# Altium schematic sheet 013_SoC GPIO 3.3V.SchDoc
size 420 x 297 mm; Page Create Date: May 29, 2006; WebSite: https://www.seeedstudio.com; Page Number: 13; Drawing: qxn; Schematic Name: BeaglePlay; Page Size: A3; Comment: Seeed Title; Page Count: 22; Page Name: 013_SoC GPIO 3.3V; Company: Seeed Studio; RevCode: v0.2; DsnPath: C:\Users\a0488739\Documents\GitHub\beagleplay\allegro\DVT\BEAGLEPLAYV020_220915.DSN; SchematicName: BeaglePlay; PageName: 013_SoC GPIO 3.3V; PageSize: A3; TopSchematic: True
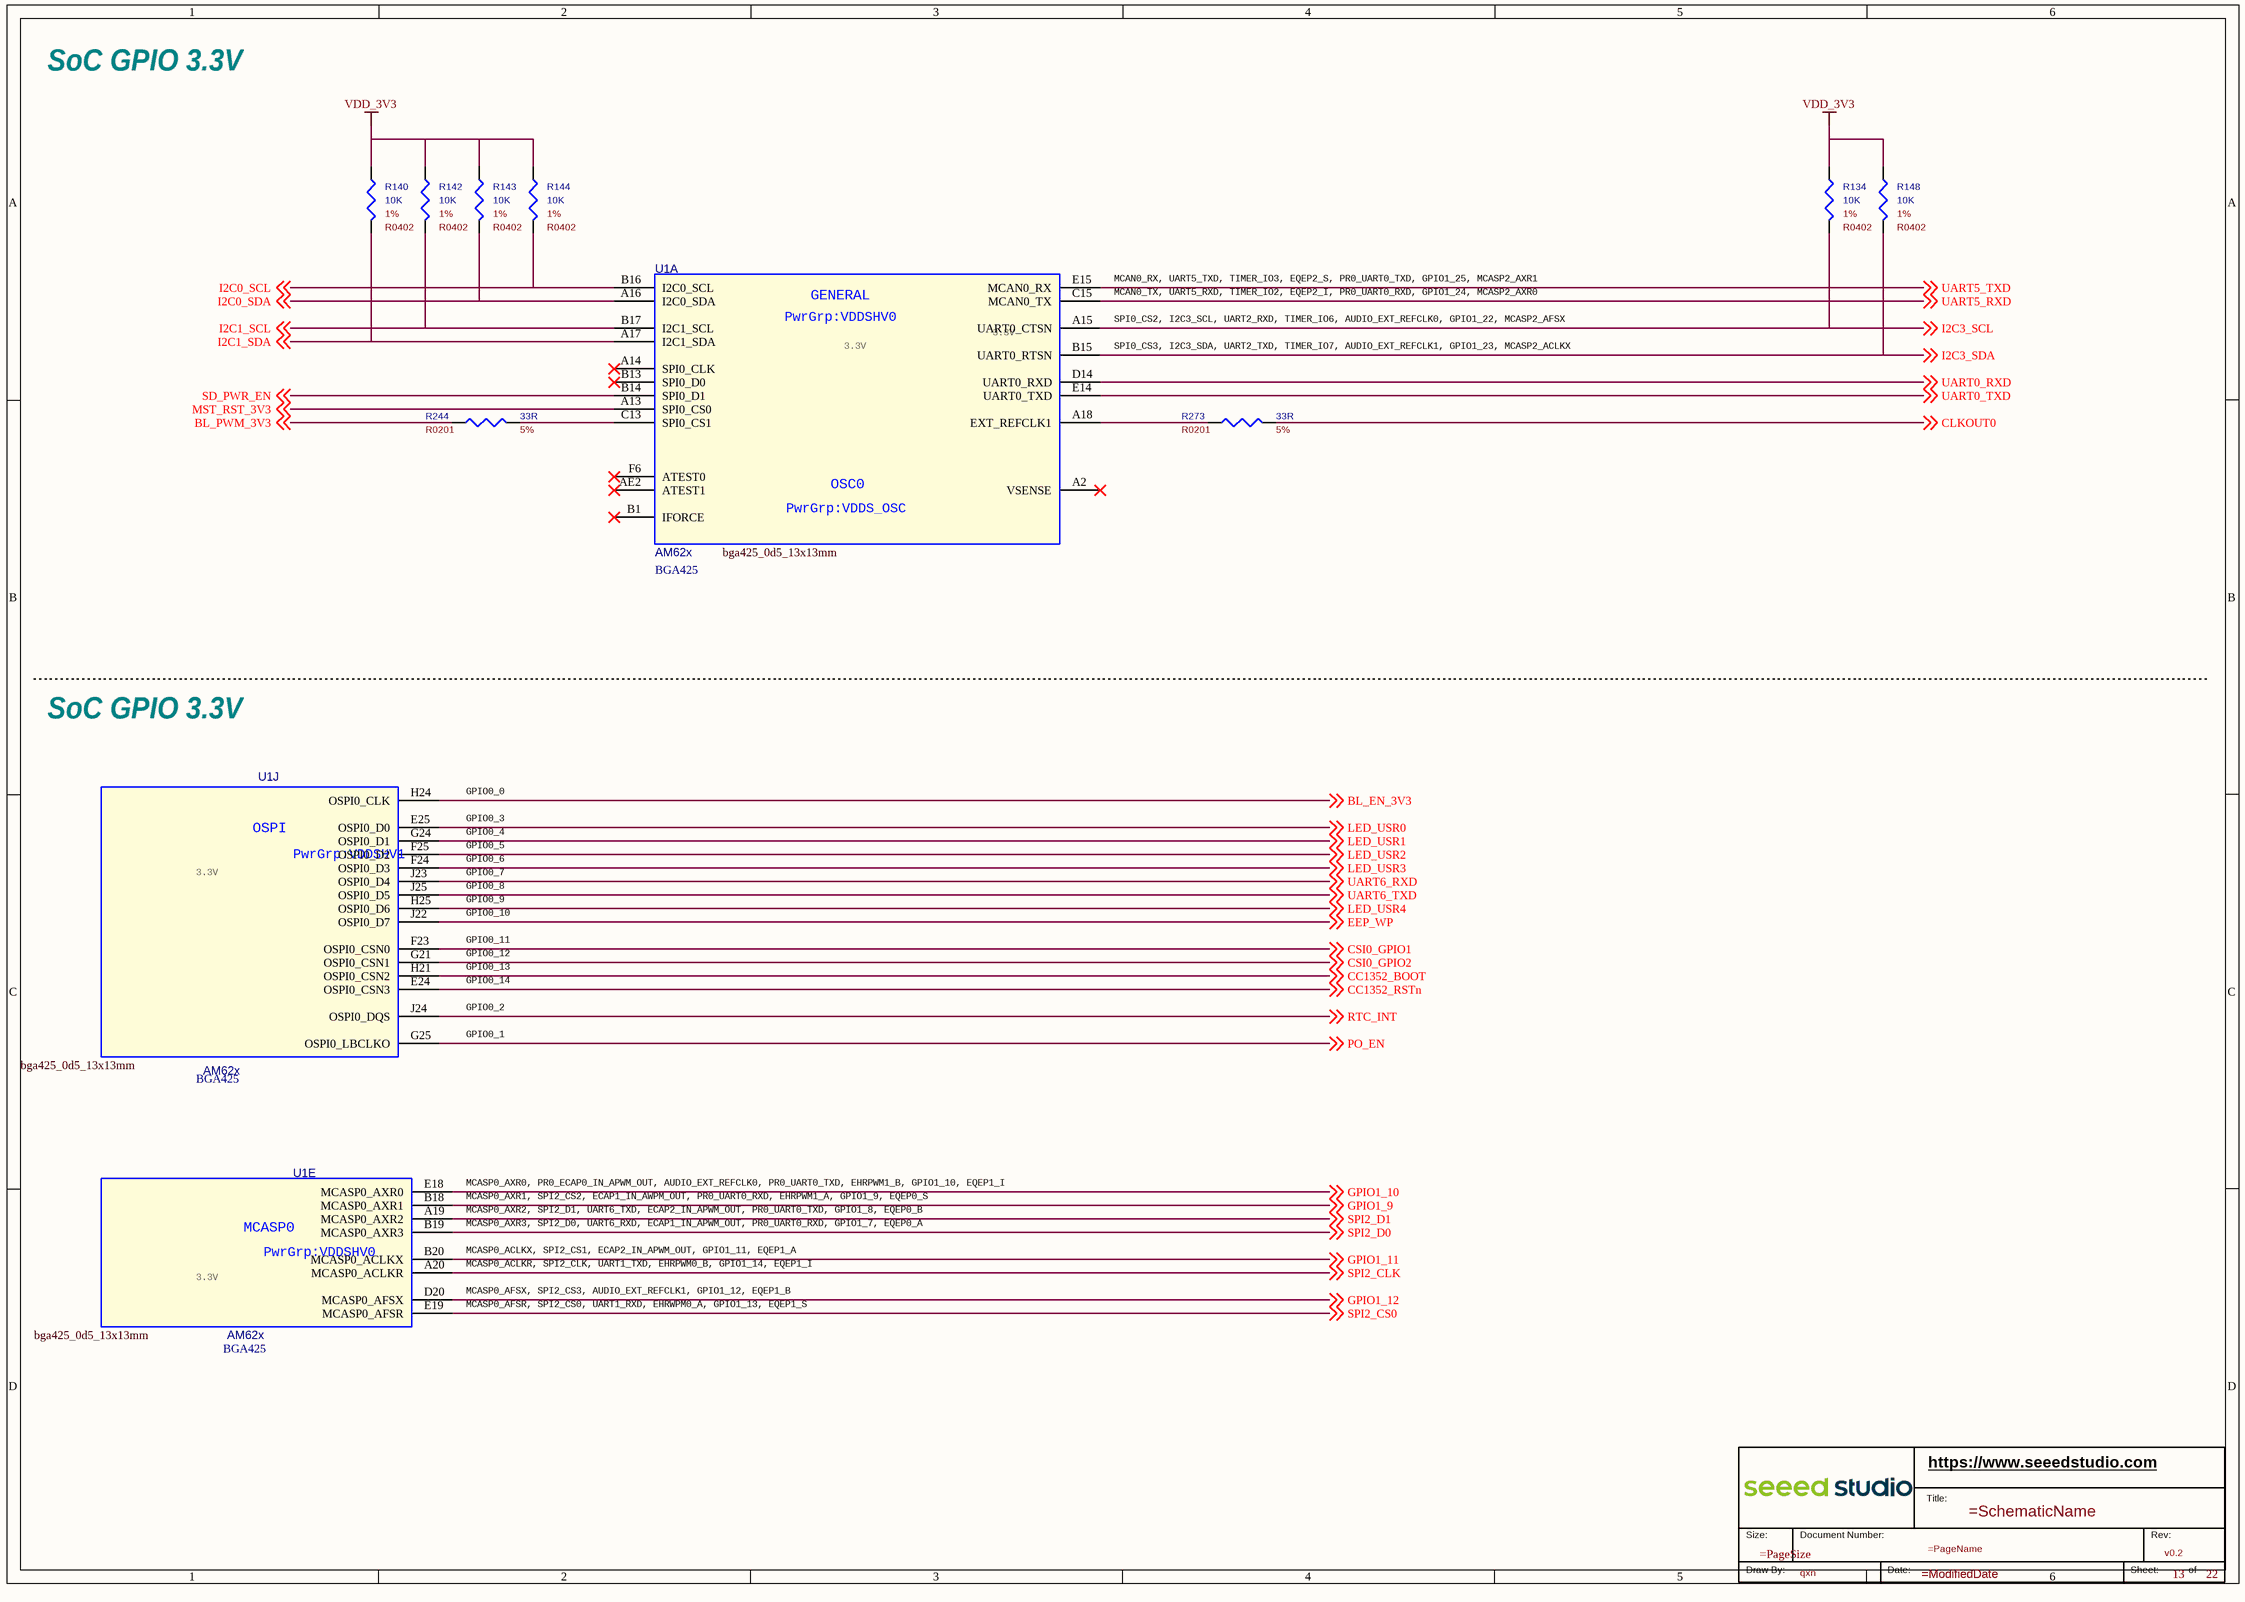
[diagram p0: 013_SoC GPIO 3.3V.SchDoc]

## Parts
*  RevCode: v0.2  Page Number: 13  Page Count: 22  Drawing: qxn  (hidden comment: Seeed Title)  (graphical)
R134  value 10K  Rating: 1%  [R0402]  (hidden comment: R)
R140  value 10K  Rating: 1%  [R0402]  (hidden comment: R)
R142  value 10K  Rating: 1%  [R0402]  (hidden comment: R)
R143  value 10K  Rating: 1%  [R0402]  (hidden comment: R)
R144  value 10K  Rating: 1%  [R0402]  (hidden comment: R)
R148  value 10K  Rating: 1%  [R0402]  (hidden comment: R)
R244  value 33R  Rating: 5%  [R0201]  (hidden comment: R)
R273  value 33R  Rating: 5%  [R0201]  (hidden comment: R)
U1  value AM62x  Package Size: BGA425  [bga425_0d5_13x13mm]  (hidden comment: AM62x_BGA425)  (parts A,E,J of 19)

## Nets
VDD_3V3: R134.1 R140.1 R142.1 R143.1 R144.1 R148.1
BL_EN_3V3: U1.H24(OSPI0_CLK) ; off-sheet BL_EN_3V3
BL_PWM_3V3: R244.1 ; off-sheet BL_PWM_3V3
CC1352_BOOT: U1.H21(OSPI0_CSN2) ; off-sheet CC1352_BOOT
CC1352_RSTn: U1.E24(OSPI0_CSN3) ; off-sheet CC1352_RSTn
CLKOUT0: R273.2 ; off-sheet CLKOUT0
CSI0_GPIO1: U1.F23(OSPI0_CSN0) ; off-sheet CSI0_GPIO1
CSI0_GPIO2: U1.G21(OSPI0_CSN1) ; off-sheet CSI0_GPIO2
EEP_WP: U1.J22(OSPI0_D7) ; off-sheet EEP_WP
GPIO1_9: U1.B18(MCASP0_AXR1) ; off-sheet GPIO1_9
GPIO1_10: U1.E18(MCASP0_AXR0) ; off-sheet GPIO1_10
GPIO1_11: U1.B20(MCASP0_ACLKX) ; off-sheet GPIO1_11
GPIO1_12: U1.D20(MCASP0_AFSX) ; off-sheet GPIO1_12
I2C0_SCL: R144.2 U1.B16(I2C0_SCL) ; off-sheet I2C0_SCL
I2C0_SDA: R143.2 U1.A16(I2C0_SDA) ; off-sheet I2C0_SDA
I2C1_SCL: R142.2 U1.B17(I2C1_SCL) ; off-sheet I2C1_SCL
I2C1_SDA: R140.2 U1.A17(I2C1_SDA) ; off-sheet I2C1_SDA
I2C3_SCL: R134.2 U1.A15(UART0_CTSN) ; off-sheet I2C3_SCL
I2C3_SDA: R148.2 U1.B15(UART0_RTSN) ; off-sheet I2C3_SDA
LED_USR0: U1.E25(OSPI0_D0) ; off-sheet LED_USR0
LED_USR1: U1.G24(OSPI0_D1) ; off-sheet LED_USR1
LED_USR2: U1.F25(OSPI0_D2) ; off-sheet LED_USR2
LED_USR3: U1.F24(OSPI0_D3) ; off-sheet LED_USR3
LED_USR4: U1.H25(OSPI0_D6) ; off-sheet LED_USR4
MST_RST_3V3: U1.A13(SPI0_CS0) ; off-sheet MST_RST_3V3
PO_EN: U1.G25(OSPI0_LBCLKO) ; off-sheet PO_EN
RTC_INT: U1.J24(OSPI0_DQS) ; off-sheet RTC_INT
SD_PWR_EN: U1.B14(SPI0_D1) ; off-sheet SD_PWR_EN
SPI2_CLK: U1.A20(MCASP0_ACLKR) ; off-sheet SPI2_CLK
SPI2_CS0: U1.E19(MCASP0_AFSR) ; off-sheet SPI2_CS0
SPI2_D0: U1.B19(MCASP0_AXR3) ; off-sheet SPI2_D0
SPI2_D1: U1.A19(MCASP0_AXR2) ; off-sheet SPI2_D1
UART0_RXD: U1.D14(UART0_RXD) ; off-sheet UART0_RXD
UART0_TXD: U1.E14(UART0_TXD) ; off-sheet UART0_TXD
UART5_RXD: U1.C15(MCAN0_TX) ; off-sheet UART5_RXD
UART5_TXD: U1.E15(MCAN0_RX) ; off-sheet UART5_TXD
UART6_RXD: U1.J23(OSPI0_D4) ; off-sheet UART6_RXD
UART6_TXD: U1.J25(OSPI0_D5) ; off-sheet UART6_TXD
NetR244_2: R244.2 U1.C13(SPI0_CS1)
NetR273_1: R273.1 U1.A18(EXT_REFCLK1)

Not connected (* = marked no-connect by the designer): U1 A2(VSENSE)* A14(SPI0_CLK)* AE2(ATEST1)* B1(IFORCE)* B13(SPI0_D0)* F6(ATEST0)*

## Notes on the sheet
- SoC GPIO 3.3V
- MCAN0_RX, UART5_TXD, TIMER_IO3, EQEP2_S, PR0_UART0_TXD, GPIO1_25, MCASP2_AXR1
- MCAN0_TX, UART5_RXD, TIMER_IO2, EQEP2_I, PR0_UART0_RXD, GPIO1_24, MCASP2_AXR0
- SPI0_CS2, I2C3_SCL, UART2_RXD, TIMER_IO6, AUDIO_EXT_REFCLK0, GPIO1_22, MCASP2_AFSX
- (near U1) 3.3V
- SPI0_CS3, I2C3_SDA, UART2_TXD, TIMER_IO7, AUDIO_EXT_REFCLK1, GPIO1_23, MCASP2_ACLKX
- GPIO0_0
- GPIO0_5
- GPIO0_3
- GPIO0_4
- GPIO0_6
- 3.3V
- GPIO0_9
- GPIO0_7
- GPIO0_8
- GPIO0_10
- GPIO0_11
- GPIO0_12
- GPIO0_13
- GPIO0_14
- GPIO0_1
- GPIO0_2
- MCASP0_AXR0, PR0_ECAP0_IN_APWM_OUT, AUDIO_EXT_REFCLK0, PR0_UART0_TXD, EHRPWM1_B, GPIO1_10, EQEP1_I
- MCASP0_AXR1, SPI2_CS2, ECAP1_IN_AWPM_OUT, PR0_UART0_RXD, EHRPWM1_A, GPIO1_9, EQEP0_S
- MCASP0_ACLKR, SPI2_CLK, UART1_TXD, EHRPWM0_B, GPIO1_14, EQEP1_I
- MCASP0_AXR3, SPI2_D0, UART6_RXD, ECAP1_IN_APWM_OUT, PR0_UART0_RXD, GPIO1_7, EQEP0_A
- MCASP0_AXR2, SPI2_D1, UART6_TXD, ECAP2_IN_APWM_OUT, PR0_UART0_TXD, GPIO1_8, EQEP0_B
- MCASP0_ACLKX, SPI2_CS1, ECAP2_IN_APWM_OUT, GPIO1_11, EQEP1_A
- MCASP0_AFSR, SPI2_CS0, UART1_RXD, EHRWPM0_A, GPIO1_13, EQEP1_S
- MCASP0_AFSX, SPI2_CS3, AUDIO_EXT_REFCLK1, GPIO1_12, EQEP1_B
- (in symbol AM62x_BGA425, part A) GENERAL; PwrGrp:VDDSHV0; OSC0; PwrGrp:VDDS_OSC
- (in symbol AM62x_BGA425, part E) MCASP0; PwrGrp:VDDSHV0
- (in symbol AM62x_BGA425, part J) OSPI; PwrGrp:VDDSHV1
- (in symbol Seeed Title) https://www.seeedstudio.com; Title:; Size:; Document Number:; Rev:; Draw By:; Date:; Sheet:; of

## Library data of the parts
* = Seeed Title: Company: Seeed Studio; WebSite: https://www.seeedstudio.com; Schematic Name: =SchematicName; Page Size: =PageSize; Page Name: =PageName; Page Create Date: May 29, 2006; Page Modify Date: =ModifiedDate
R134 = R: RES, Thick Film, 10K, 1%, 1/16W, SMD, 0402; Part Reference: R134; Manufacturer PN: RC0402FR-0710KL; Manufacturer: YAGEO; Company Part Status: BeagleBone Carrier Board; CLASS: DISCRETE; PN: 301010047; PCB Footprint: R0402; Package Size: 0402; Rated Power: 1/16W
R140 = R: RES, Thick Film, 10K, 1%, 1/16W, SMD, 0402; Part Reference: R140; Company Part Status: BeagleBone Carrier Board; Manufacturer: YAGEO; Manufacturer PN: RC0402FR-0710KL; PN: 301010047; CLASS: DISCRETE; PCB Footprint: R0402; Package Size: 0402; Rated Power: 1/16W
R142 = R: RES, Thick Film, 10K, 1%, 1/16W, SMD, 0402; Part Reference: R142; Company Part Status: BeagleBone Carrier Board; Manufacturer: YAGEO; Manufacturer PN: RC0402FR-0710KL; PN: 301010047; CLASS: DISCRETE; PCB Footprint: R0402; Package Size: 0402; Rated Power: 1/16W
R143 = R: RES, Thick Film, 10K, 1%, 1/16W, SMD, 0402; Part Reference: R143; Company Part Status: BeagleBone Carrier Board; Manufacturer: YAGEO; Manufacturer PN: RC0402FR-0710KL; PN: 301010047; CLASS: DISCRETE; PCB Footprint: R0402; Package Size: 0402; Rated Power: 1/16W
R144 = R: RES, Thick Film, 10K, 1%, 1/16W, SMD, 0402; Part Reference: R144; Company Part Status: BeagleBone Carrier Board; Manufacturer: YAGEO; Manufacturer PN: RC0402FR-0710KL; PN: 301010047; CLASS: DISCRETE; PCB Footprint: R0402; Package Size: 0402; Rated Power: 1/16W
R148 = R: RES, Thick Film, 10K, 1%, 1/16W, SMD, 0402; Part Reference: R148; Manufacturer PN: RC0402FR-0710KL; Manufacturer: YAGEO; Company Part Status: BeagleBone Carrier Board; CLASS: DISCRETE; PN: 301010047; PCB Footprint: R0402; Package Size: 0402; Rated Power: 1/16W
R244 = R: RES, Thick Film, 33R, 5%, 1/20W, SMD, 0201; Part Reference: R244; Company Part Status: BeagleBone Carrier Board; Manufacturer: YAGEO; Manufacturer PN: RC0201JR-0733RL; PN: 301010675; CLASS: DISCRETE; PCB Footprint: R0201; Package Size: 0201; Rated Power: 1/20W
R273 = R: RES, Thick Film, 33R, 5%, 1/20W, SMD, 0201; Part Reference: R273; Manufacturer PN: RC0201JR-0733RL; Manufacturer: YAGEO; Company Part Status: BeagleBone Carrier Board; CLASS: DISCRETE; PN: 301010675; PCB Footprint: R0201; Rated Power: 1/20W; Package Size: 0201
U1 = AM62x_BGA425: IC, Controller, MPU, AM62x, BGA425; Part Reference: U1; Manufacturer PN: AM6254ATCGGHALWR; Manufacturer: TI; Company Part Status: BeaglePlay; PN: 310011537; PCB Footprint: bga425_0d5_13x13mm; CLASS: IC